# Altium schematic sheet Analog Output.SchDoc
size A4; SheetNumber: 7; SheetTotal: 11
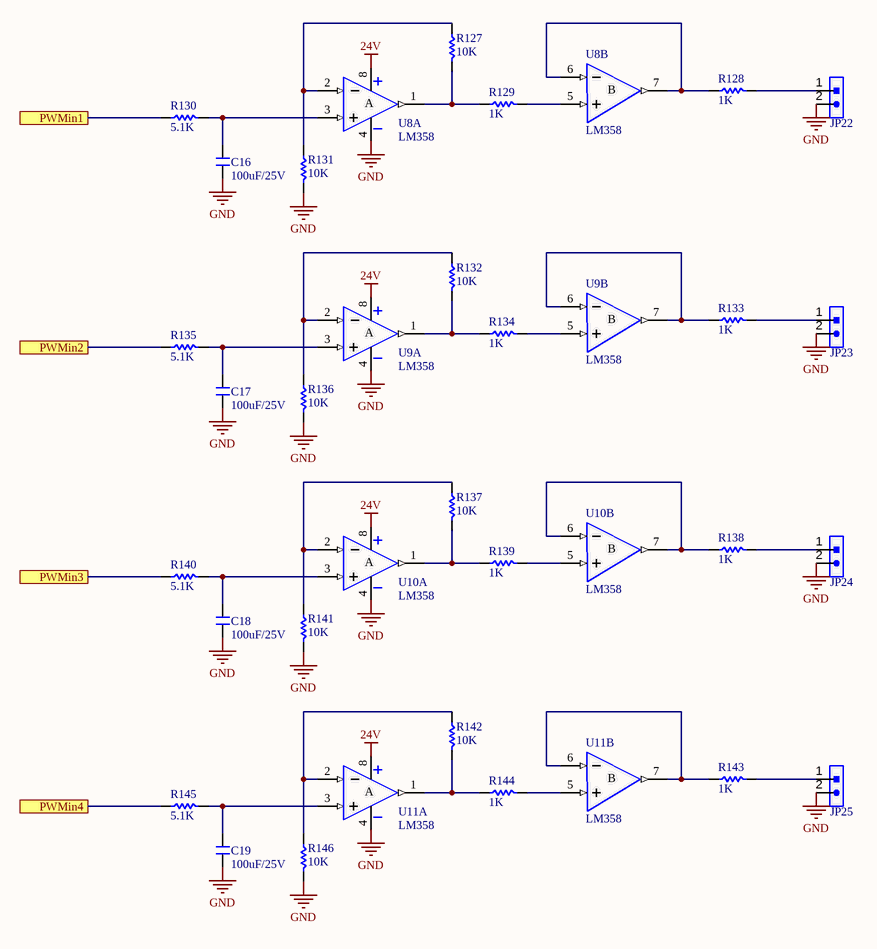
[diagram p0: Analog Output.SchDoc]

## Parts
C16  100uF/25V  [C 0805]
C17  100uF/25V  [C 0805]
C18  100uF/25V  [C 0805]
C19  100uF/25V  [C 0805]
JP22  HDR-1X2  [KF301-2P]  (value not drawn)
JP23  HDR-1X2  [KF301-2P]  (value not drawn)
JP24  HDR-1X2  [KF301-2P]  (value not drawn)
JP25  HDR-1X2  [KF301-2P]  (value not drawn)
R127  10K  [R 0805]
R128  1K  [R 0805]
R129  1K  [R 0805]
R130  5.1K  [R 0805]
R131  10K  [R 0805]
R132  10K  [R 0805]
R133  1K  [R 0805]
R134  1K  [R 0805]
R135  5.1K  [R 0805]
R136  10K  [R 0805]
R137  10K  [R 0805]
R138  1K  [R 0805]
R139  1K  [R 0805]
R140  5.1K  [R 0805]
R141  10K  [R 0805]
R142  10K  [R 0805]
R143  1K  [R 0805]
R144  1K  [R 0805]
R145  5.1K  [R 0805]
R146  10K  [R 0805]
U8  LM358  [SOP8_N]  (parts A,B of 2)
U9  LM358  [SOP8_N]  (parts A,B of 2)
U10  LM358  [SOP8_N]  (parts A,B of 2)
U11  LM358  [SOP8_N]  (parts A,B of 2)

## Ports
PWMin1, PWMin2, PWMin3, PWMin4

## Nets
24V: U8.8(VCC+) U9.8(VCC+) U10.8(VCC+) U11.8(VCC+)
GND: C16.2 C17.2 C18.2 C19.2 JP22.2 JP23.2 JP24.2 JP25.2 R131.2 R136.2 R141.2 R146.2 U8.4(VCC-) U9.4(VCC-) U10.4(VCC-) U11.4(VCC-)
PWMin1: R130.1 ; port PWMin1
PWMin2: R135.1 ; port PWMin2
PWMin3: R140.1 ; port PWMin3
PWMin4: R145.1 ; port PWMin4
NetC16_1: C16.1 R130.2 U8.3(IN1+)
NetC17_1: C17.1 R135.2 U9.3(IN1+)
NetC18_1: C18.1 R140.2 U10.3(IN1+)
NetC19_1: C19.1 R145.2 U11.3(IN1+)
NetJP22_1: JP22.1 R128.2
NetJP23_1: JP23.1 R133.2
NetJP24_1: JP24.1 R138.2
NetJP25_1: JP25.1 R143.2
NetR127_1: R127.1 R131.1 U8.2(IN1-)
NetR127_2: R127.2 R129.1 U8.1(OUT1)
NetR128_1: R128.1 U8.6(IN2-) U8.7(OUT2)
NetR129_2: R129.2 U8.5(IN2+)
NetR132_1: R132.1 R136.1 U9.2(IN1-)
NetR132_2: R132.2 R134.1 U9.1(OUT1)
NetR133_1: R133.1 U9.6(IN2-) U9.7(OUT2)
NetR134_2: R134.2 U9.5(IN2+)
NetR137_1: R137.1 R141.1 U10.2(IN1-)
NetR137_2: R137.2 R139.1 U10.1(OUT1)
NetR138_1: R138.1 U10.6(IN2-) U10.7(OUT2)
NetR139_2: R139.2 U10.5(IN2+)
NetR142_1: R142.1 R146.1 U11.2(IN1-)
NetR142_2: R142.2 R144.1 U11.1(OUT1)
NetR143_1: R143.1 U11.6(IN2-) U11.7(OUT2)
NetR144_2: R144.2 U11.5(IN2+)

## Notes on the sheet
- (in symbol LM358, part A) A
- (in symbol LM358, part B) B

## Library data of the parts
C16-C19 = C: Non-polar patch capacitor; BOM名称: 无极性贴片电容; 版权归属: 源创客; 学习资源: www.ooocke.com
JP22-JP25 = Header 2: 2P Connector; BOM名称: 2P接插件; 版权归属: 源创客; 学习资源: www.ooocke.com
R127-R146 = R: Chip resistor; 版权归属: 源创客; BOM名称: Chip resistor; 学习资源: www.ooocke.com
U8-U11 = LM358: Dual op amp; BOM名称: 双路运放; 版权归属: 源创客; 学习资源: www.ooocke.com